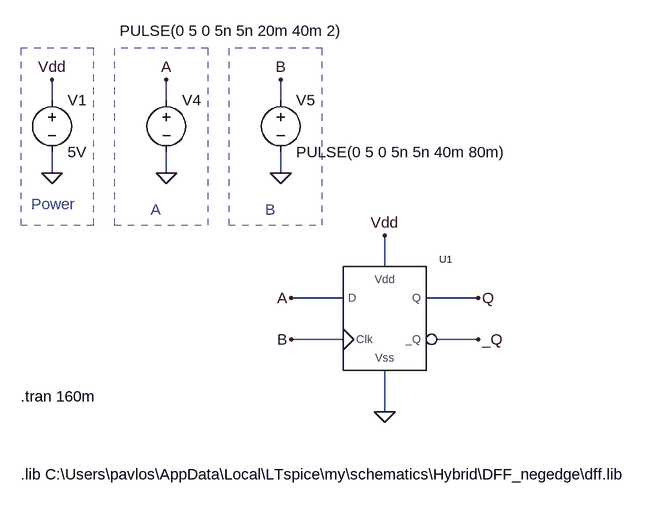
[diagram p0: schematic dff_block.asc]
dff_block.asc, the LTspice schematic file:
Version 4
SHEET 1 896 680
WIRE -560 -416 -560 -448
WIRE -384 -416 -384 -448
WIRE -208 -416 -208 -448
WIRE -560 -304 -560 -336
WIRE -384 -304 -384 -336
WIRE -208 -304 -208 -336
WIRE -48 -160 -48 -208
WIRE -112 -112 -192 -112
WIRE 96 -112 16 -112
WIRE -112 -48 -192 -48
WIRE 96 -48 32 -48
WIRE -48 64 -48 0
FLAG 96 -112 Q
FLAG -192 -112 A
FLAG -48 -208 Vdd
FLAG -48 64 0
FLAG -560 -304 0
FLAG -560 -448 Vdd
FLAG -192 -48 B
FLAG 96 -48 _Q
FLAG -384 -304 0
FLAG -384 -448 A
FLAG -208 -304 0
FLAG -208 -448 B
SYMBOL voltage -560 -432 R0
WINDOW 123 0 0 Left 0
WINDOW 39 0 0 Left 0
SYMATTR InstName V1
SYMATTR Value 5V
SYMBOL voltage -384 -432 R0
WINDOW 123 0 0 Left 0
WINDOW 39 0 0 Left 0
WINDOW 3 -72 -91 Left 2
SYMATTR Value PULSE(0 5 0 5n 5n 20m 40m 2)
SYMATTR InstName V4
SYMBOL voltage -208 -432 R0
WINDOW 123 0 0 Left 0
WINDOW 39 0 0 Left 0
SYMATTR InstName V5
SYMATTR Value PULSE(0 5 0 5n 5n 40m 80m)
SYMBOL dff -112 0 R0
SYMATTR InstName U1
TEXT -592 -256 Left 2 ;Power
TEXT -608 40 Left 2 !.tran 160m
TEXT -608 160 Left 2 !.lib C:\\Users\\pavlos\\AppData\\Local\\LTspice\\my\\schematics\\Hybrid\\DFF_negedge\\dff.lib
TEXT -408 -248 Left 2 ;A
TEXT -232 -248 Left 2 ;B
RECTANGLE Normal -496 -496 -608 -224 2
RECTANGLE Normal -320 -496 -464 -224 2
RECTANGLE Normal -144 -496 -288 -224 2

The netlist it stands for:
* dff_block.asc
V1 Vdd 0 5V
V4 A 0 PULSE(0 5 0 5n 5n 20m 40m 2)
V5 B 0 PULSE(0 5 0 5n 5n 40m 80m)
XU1 A B Q _Q Vdd 0 dff  ; pins D Clk Q _Q Vdd Vss
* Power
.tran 160m
.lib C:\Users\pavlos\AppData\Local\LTspice\my\schematics\Hybrid\DFF_negedge\dff.lib
* A
* B
.backanno
.end

* Results of the author's LTspice run, read from the files saved beside the schematic
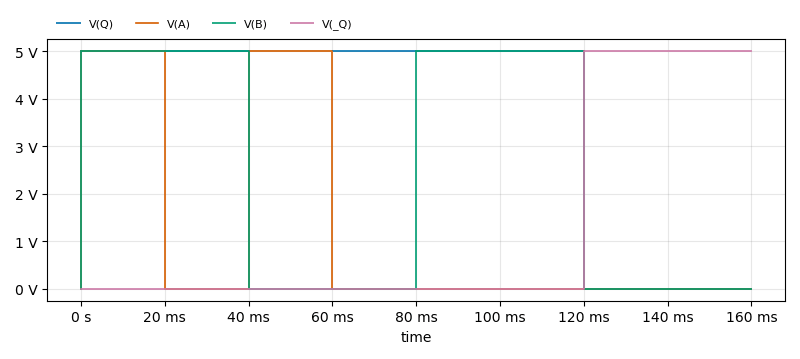
[diagram p1: Transient Analysis of dff_block.asc, plotted from the saved traces]
* Transient Analysis, 1 run:
*   V(Q): min -47.06 µV, max 5 V, average 3.75 V, rms 4.33 V, last 0 V
*   V(A): min 0 V, max 5 V, average 1.25 V, rms 2.5 V, last 0 V
*   V(B): min 0 V, max 5 V, average 2.5 V, rms 3.536 V, last 0 V
*   V(_Q): min 0 V, max 5 V, average 1.25 V, rms 2.5 V, last 5 V